# EAGLE schematic 3i v4 (EAGLE 9.7.0)
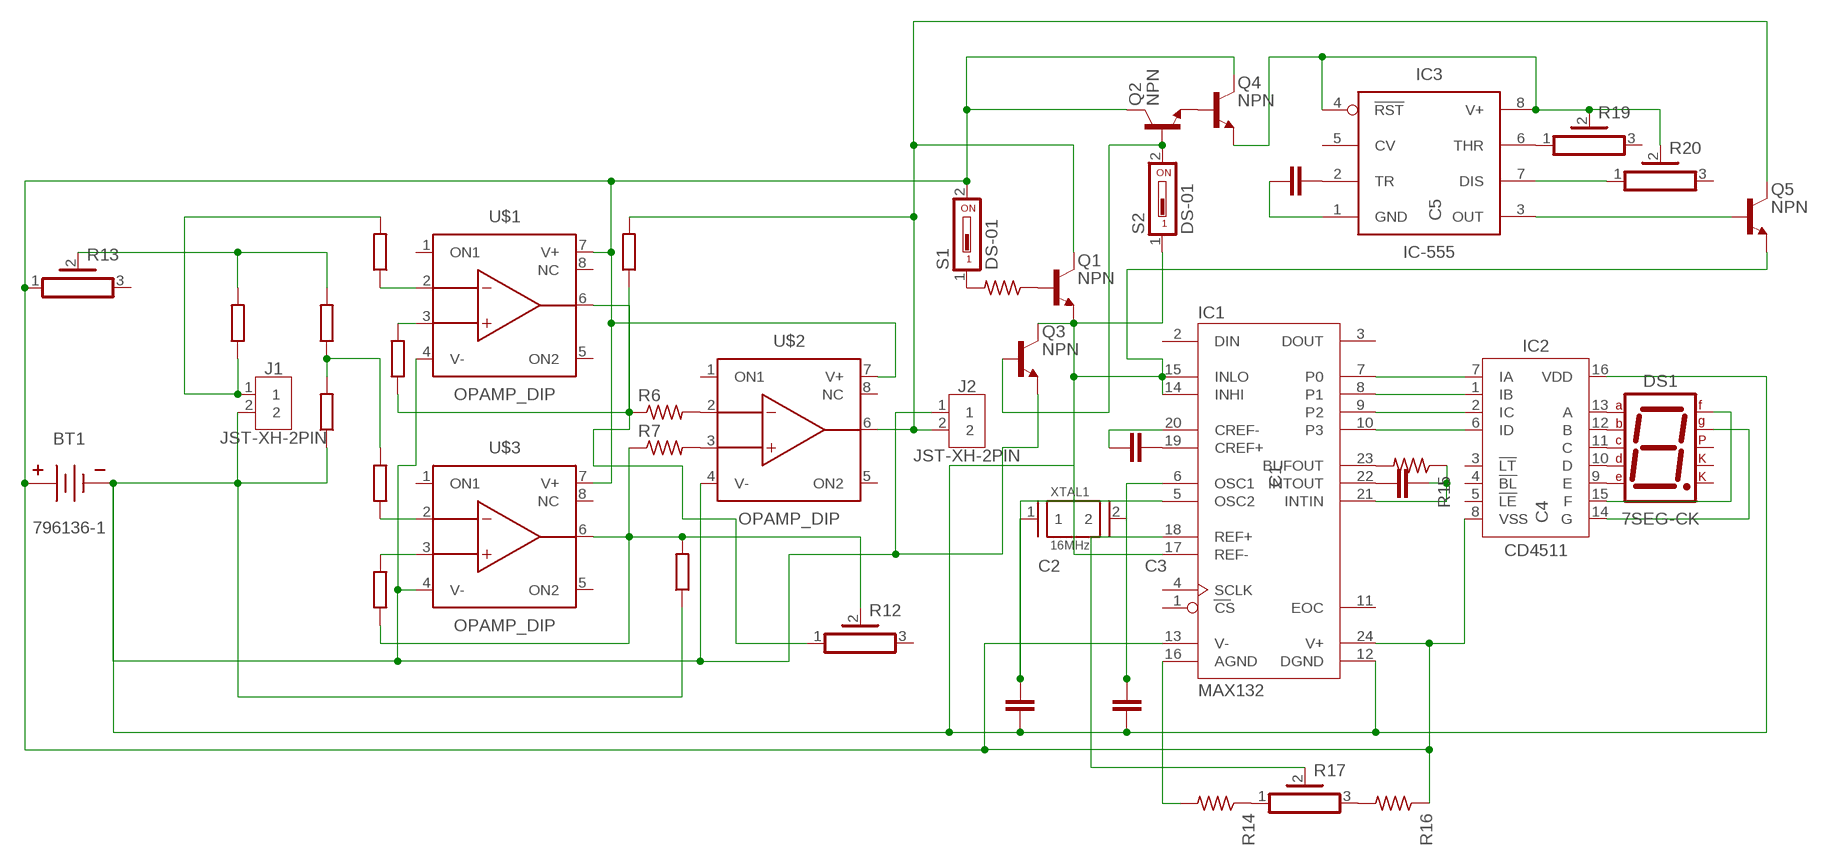
[diagram p0: schematic, sheet 1]

## Parts
BT1  796136-1  [796136-1]
C1  C_CHIP-1812(4532-METRIC)  [CAPC4532X135]
C2  C_CHIP-1812(4532-METRIC)  [CAPC4532X135]
C3  C_CHIP-1812(4532-METRIC)  [CAPC4532X135]
C4  C_CHIP-1812(4532-METRIC)  [CAPC4532X135]
C5  C_CHIP-1812(4532-METRIC)  [CAPC4532X135]
DS1  7SEG-CK  [7SEG-13]
IC1  MAX132  MAX132ENG  [DIL24-3]
IC2  CD4511  CD4511_PDIP  [DIP762W53P254L1969H508Q16B]
IC3  IC-555  ICM7555_DIP  [DIP826W53P254L959H508Q8B]
J1  JST-XH-2PIN  B2B-XH-A  [B2B-XH-A]
J2  JST-XH-2PIN  B2B-XH-A  [B2B-XH-A]
Q1  NPN  NPN_TO18-EBC  [TO18]
Q2  NPN  NPN_TO18-EBC  [TO18]
Q3  NPN  NPN_TO18-EBC  [TO18]
Q4  NPN  NPN_TO18-EBC  [TO18]
Q5  NPN  NPN_TO18-EBC  [TO18]
R1  R_CHIP-2010(5025-METRIC)  [RESC5025X71]
R2  R_CHIP-2010(5025-METRIC)  [RESC5025X71]
R3  R_CHIP-2010(5025-METRIC)  [RESC5025X71]
R4  R_CHIP-2010(5025-METRIC)  [RESC5025X71]
R5  R_CHIP-2010(5025-METRIC)  [RESC5025X71]
R6  R-US_CHIP-1210(3225-METRIC)  [RESC3224X71]
R7  R-US_CHIP-1210(3225-METRIC)  [RESC3224X71]
R8  R_CHIP-2010(5025-METRIC)  [RESC5025X71]
R9  R_CHIP-2010(5025-METRIC)  [RESC5025X71]
R10  R_CHIP-2010(5025-METRIC)  [RESC5025X71]
R11  R_CHIP-2010(5025-METRIC)  [RESC5025X71]
R12  PV36Z  [PV36Z]
R13  PV36Z  [PV36Z]
R14  R-US_CHIP-1210(3225-METRIC)  [RESC3224X71]
R15  R-US_CHIP-1210(3225-METRIC)  [RESC3224X71]
R16  R-US_CHIP-1210(3225-METRIC)  [RESC3224X71]
R17  PV36Z  [PV36Z]
R18  R-US_CHIP-1210(3225-METRIC)  [RESC3224X71]
R19  PV36Z  [PV36Z]
R20  PV36Z  [PV36Z]
S1  DS-01  DS01  [DS-01]
S2  DS-01  DS01  [DS-01]
U$1  OPAMP_DIP  [DIP826W53P254L959H508Q8B]
U$2  OPAMP_DIP  [DIP826W53P254L959H508Q8B]
U$3  OPAMP_DIP  [DIP826W53P254L959H508Q8B]
XTAL1  16MHz  ABLS  [XTAL1147X477X420N]

## Nets
N$1: R1.2 R2.2 R13.2
N$2: R2.1 R4.2 R5.2
N$3: C1.1 IC1.19(CREF+)
N$4: J1.1 R1.1 R3.2
N$5: R3.1 U$1.2(-IN)
N$6: R5.1 U$3.2(-IN)
N$7: R6.2 U$2.2(-IN)
N$8: R7.2 U$2.3(+IN)
N$9: R6.1 R9.1 R11.1 R12.1 U$1.6(OUT)
N$10: R7.1 R8.1 R10.2 R12.2 U$3.6(OUT)
N$11: R9.2 U$1.3(+IN)
N$12: R8.2 U$3.3(+IN)
N$13: J2.2 Q1.3(C) Q5.3(C) R11.2 U$2.6(OUT)
N$14: BT1.N(-) C2.2 C3.2 IC1.12(DGND) IC2.16(VDD) J1.2 J2.1 Q3.1(E) R4.1 R10.1 U$1.4(V-) U$2.4(V-) U$3.4(V-)
N$15: BT1.P(+) IC1.13(V-) IC1.24(V+) IC2.8(VSS) Q2.3(C) Q4.3(C) R13.1 R16.1 S1.2 U$1.7(V+) U$2.7(V+) U$3.7(V+)
N$16: C1.2 IC1.20(CREF-)
N$17: IC1.7(P0) IC2.7(IA)
N$18: IC1.8(P1) IC2.1(IB)
N$19: IC1.9(P2) IC2.2(IC)
N$20: IC1.10(P3) IC2.6(ID)
N$21: C3.1 IC1.6(OSC1) XTAL1.2
N$22: C2.1 IC1.5(OSC2) XTAL1.1
N$23: R14.1 R17.1
N$24: R16.2 R17.3
N$25: IC1.16(AGND) R14.2
N$26: IC1.18(REF+) R17.2
N$27: IC1.23(BUFOUT) R15.2
N$28: C4.2 IC1.22(INTOUT)
N$29: C4.1 IC1.21(INTIN) R15.1
N$30: DS1.1(E) IC2.9(E)
N$31: DS1.2(D) IC2.10(D)
N$32: DS1.4(C) IC2.11(C)
N$33: DS1.6(B) IC2.12(B)
N$34: DS1.7(A) IC2.13(A)
N$35: DS1.9(F) IC2.15(F)
N$36: DS1.10(G) IC2.14(G)
N$37: Q2.1(E) Q4.2(B)
N$38: Q1.2(B) R18.1
N$39: R18.2 S1.1
N$40: Q2.2(B) Q3.2(B) S2.2
N$41: IC3.4(!RST) IC3.8(V+) Q4.1(E) R19.2 R20.2
N$42: IC1.14(INHI) IC1.15(INLO) IC1.17(REF-) Q1.1(E) Q3.3(C) Q5.1(E) S2.1
N$43: C5.1 IC3.2(TR)
N$44: C5.2 IC3.1(GND)
N$45: IC3.6(THR) R19.1
N$46: IC3.7(DIS) R20.1
N$47: IC3.3(OUT) Q5.2(B)
Unconnected: DS1.3(CK1) DS1.5(DP) DS1.8(CK2) IC1.1(CS) IC1.2(DIN) IC1.3(DOUT) IC1.4(SCLK) IC1.11(EOC) IC2.3(!LT) IC2.4(!BL) IC2.5(!LE) IC3.5(CV) R12.3 R13.3 R19.3 R20.3 U$1.1(ON1) U$1.5(ON2) U$1.8(NC) U$2.1(ON1) U$2.5(ON2) U$2.8(NC) U$3.1(ON1) U$3.5(ON2) U$3.8(NC)

## Library data of the parts
BT1 = Battery_Holder:796136-1: Battery Holder - Coin Cell SMD, 20.0mm Datasheet <https://www.te.com/commerce/DocumentDelivery/DDEController?Action=showdoc&DocId=Customer+Drawing%7F796136%7FG5%7Fpdf%7FEnglish%7FENG_CD_796136_G5.pdf%7F796136-1>; CATEGORY: Battery-Holder; MANUFACTURER: TE Connectivity AMP Connectors; MPN: 796136-1; PART_STATUS: ACTIVE; ROHS_COMPLIANCE: Compliant; SERIES: 2032; SUB_CATEGORY: Holder; TYPE: Coin Cell
C1-C5 = Tutorial - Fusion 360:C: Capacitor - Generic; CATEGORY: Capacitor
DS1 = Opto-Electronic:7SEG-CK: 7-segment DISPLAY single cathode, 13 mm; CATEGORY: Opto-Electronic; SUB-CATEGORY: Display; TYPE: 7-Segment
IC1 = IC_Data-Conversion:MAX132*: ±18-Bit ADC with Serial Interface Datasheet <https://datasheets.maximintegrated.com/en/ds/MAX132.pdf>; CATEGORY: IC_Data-Conversion; DESCRIPTION: IC ADC 18BIT MULTI-SLOPE 24DIP; MANUFACTURER: Maxim Integrated; MPN: MAX132ENG; OPERATING_TEMP: -40°C to 85°C; PART_STATUS: Active; ROHS_COMPLIANT: RoHS3 Compliant; SERIES: MAX132; SUB-CATEGORY: A/D Converter
IC2 = IC_Logic:CD4511: BCD to 7-segment Latch/Decoder/Driver Reference Datasheet <https://www.ti.com/lit/ds/symlink/cd4511b.pdf>; CATEGORY: IC_Logic; DESCRIPTION: BCD to 7-segment Latch; MANUFACTURER: Generic; MPN: Generic; SUB-CATEGORY: Latch; TYPE: BCD to 7-seg
IC3 = IC_Clock-Timing:*555: TIMER 555 General purpose precision timers NE555 : Texas Datasheet <http://www.ti.com/general/docs/suppproductinfo.tsp?distId=10&gotoUrl=http%3A%2F%2Fwww.ti.com%2Flit%2Fgpn%2Fne555>, Diodes Incorporated Datasheet <https://www.diodes.com/assets/Datasheets/NE555_SA555_NA555.pdf> LM555 Datasheet <http://www.ti.com/general/docs/suppproductinfo.tsp?distId=10&gotoUrl=http%3A%2F%2Fwww.ti.com%2Flit%2Fgpn%2Flm555> LMC555 Datasheet <http://www.ti.com/general/docs/suppproductinfo.tsp?distId=10&gotoUrl=http%3A%2F%2Fwww.ti.com%2Flit%2Fgpn%2Flmc555> ICM7555 : Maxim Integrated Datasheet <https://datasheets.maximintegrated.com/en/ds/ICM7555-ICM7556.pdf>, Renesas Electronics America Inc Datasheet <https://www.renesas.com/en-us/www/doc/datasheet/icm7555-56.pdf>; CATEGORY: IC_Clock-Timing; CURRENT-SUPPLY: 60µA; DESCRIPTION: IC OSC SINGLE TIMER 1MHZ 8DIP; FREQUENCY: 1MHz; MANUFACTURER: Renesas Electronics America Inc; MPN: ICM7555IPAZ; OPERATING_TEMP: -25°C to 85°C; PART_STATUS: Active; ROHS_COMPLIANT: ROHS3 Compliant; SUB-CATEGORY: Timer
J1 J2 = Connector:B2B-XH-A: XH Connector Top Entry - 2POS Details see: Datasheet <http://www.jst-mfg.com/product/pdf/eng/eXH.pdf>; CATEGORY: Header; DESCRIPTION: Connector Header Through Hole 2 position 0.098" (2.50mm); MANUFACTURER: JST Sales America Inc.; MPN: B2B-XH-A(LF)(SN); OPERATING_TEMPERATURE: -25°C ~ 85°C; PART_STATUS: ACTIVE; PITCH: 0.098" (2.50mm); ROHS_COMPLIANCE: ROHS3 Compliant; SERIES: XH; SUB_CATEGORY: Rectangular Connectors; TYPE: Header, Male Pin, Board to Cable/Wire, Through Hole
Q1-Q5 = Transistor:NPN: NPN - Generic; CATEGORY: Transistor; SUB-CATEGORY: BJT; TYPE: NPN
R1-R5 R8-R11 = Resistor:R: Resistor Fixed - Generic; CATEGORY: Resistor; SUB-CATEGORY: Fixed
R6 R7 R14-R16 R18 = Tutorial - Fusion 360:R-US: Resistor Fixed - ANSI; CATEGORY: Resistor; SUB-CATEGORY: Fixed
R12 R13 R17 R19 R20 = Resistor:PV36: Rectangular Trimmer Potentiometers - PV36 Series Datasheet <https://www.bourns.com/docs/Product-Datasheets/pv36.pdf>; CATEGORY: Resistor; DESCRIPTION: Lead Sealed Type Multiturn PV36 Series; MANUFACTURER: BOURNS; MPN: PV36Z; OPERATING_TEMPERATURE: -55 to +125 °C; PART_STATUS: Active; ROHS_COMPLIANCE: RoHS Compliant; SERIES: PV36; SUB-CATEGORY: Trimpot; TYPE: Lead Sealed
S1 S2 = Switch:DS01: DIL/CODE SWITCH; CATEGORY: SWITCH; TYPE: SPST
U$1-U$3 = Tinkercad:OPAMP
XTAL1 = Frequency-Source:ABLS: HC/49US (AT49) SMD LOW PROFILE CRYSTAL Datasheet <https://abracon.com/Resonators/abls.pdf>; CATEGORY: HC/49US (AT49) SMD LOW PROFILE CRYSTAL; DESCRIPTION: Crystal 16MHZ SMD 11.5 x 4.7 x 4.2 mm; FREQUENCY: 16MHZ; MANUFACTURER: ABRACON; MPN: ABLS-16.000MHZ-S-R500MD2XF; OPERATING_TEMPERATURE: -40°C ~ +85°C; PART_STATUS: ACTIVE; ROHS_COMPLIANT: COMPLIANT; SERIES: ABLS; SUB_CATEGORY: Crystal; TOLERANCE: 20PPM; TYPE: Low Profile Crystal